# Altium schematic sheet Board_Diagram.SchDoc: STM32F446 CNC
size B; Author: AM; CompanyName: Expatria Technologies; DrawnBy: A.Marles; Engineer: AM; Organization: Expatria Technolgoies; Address1: PO Box 2084; Address3: Merritt, BC V1K 1B8; Address4: Canada; DocumentNumber: 2; SheetNumber: 2; SheetTotal: 26
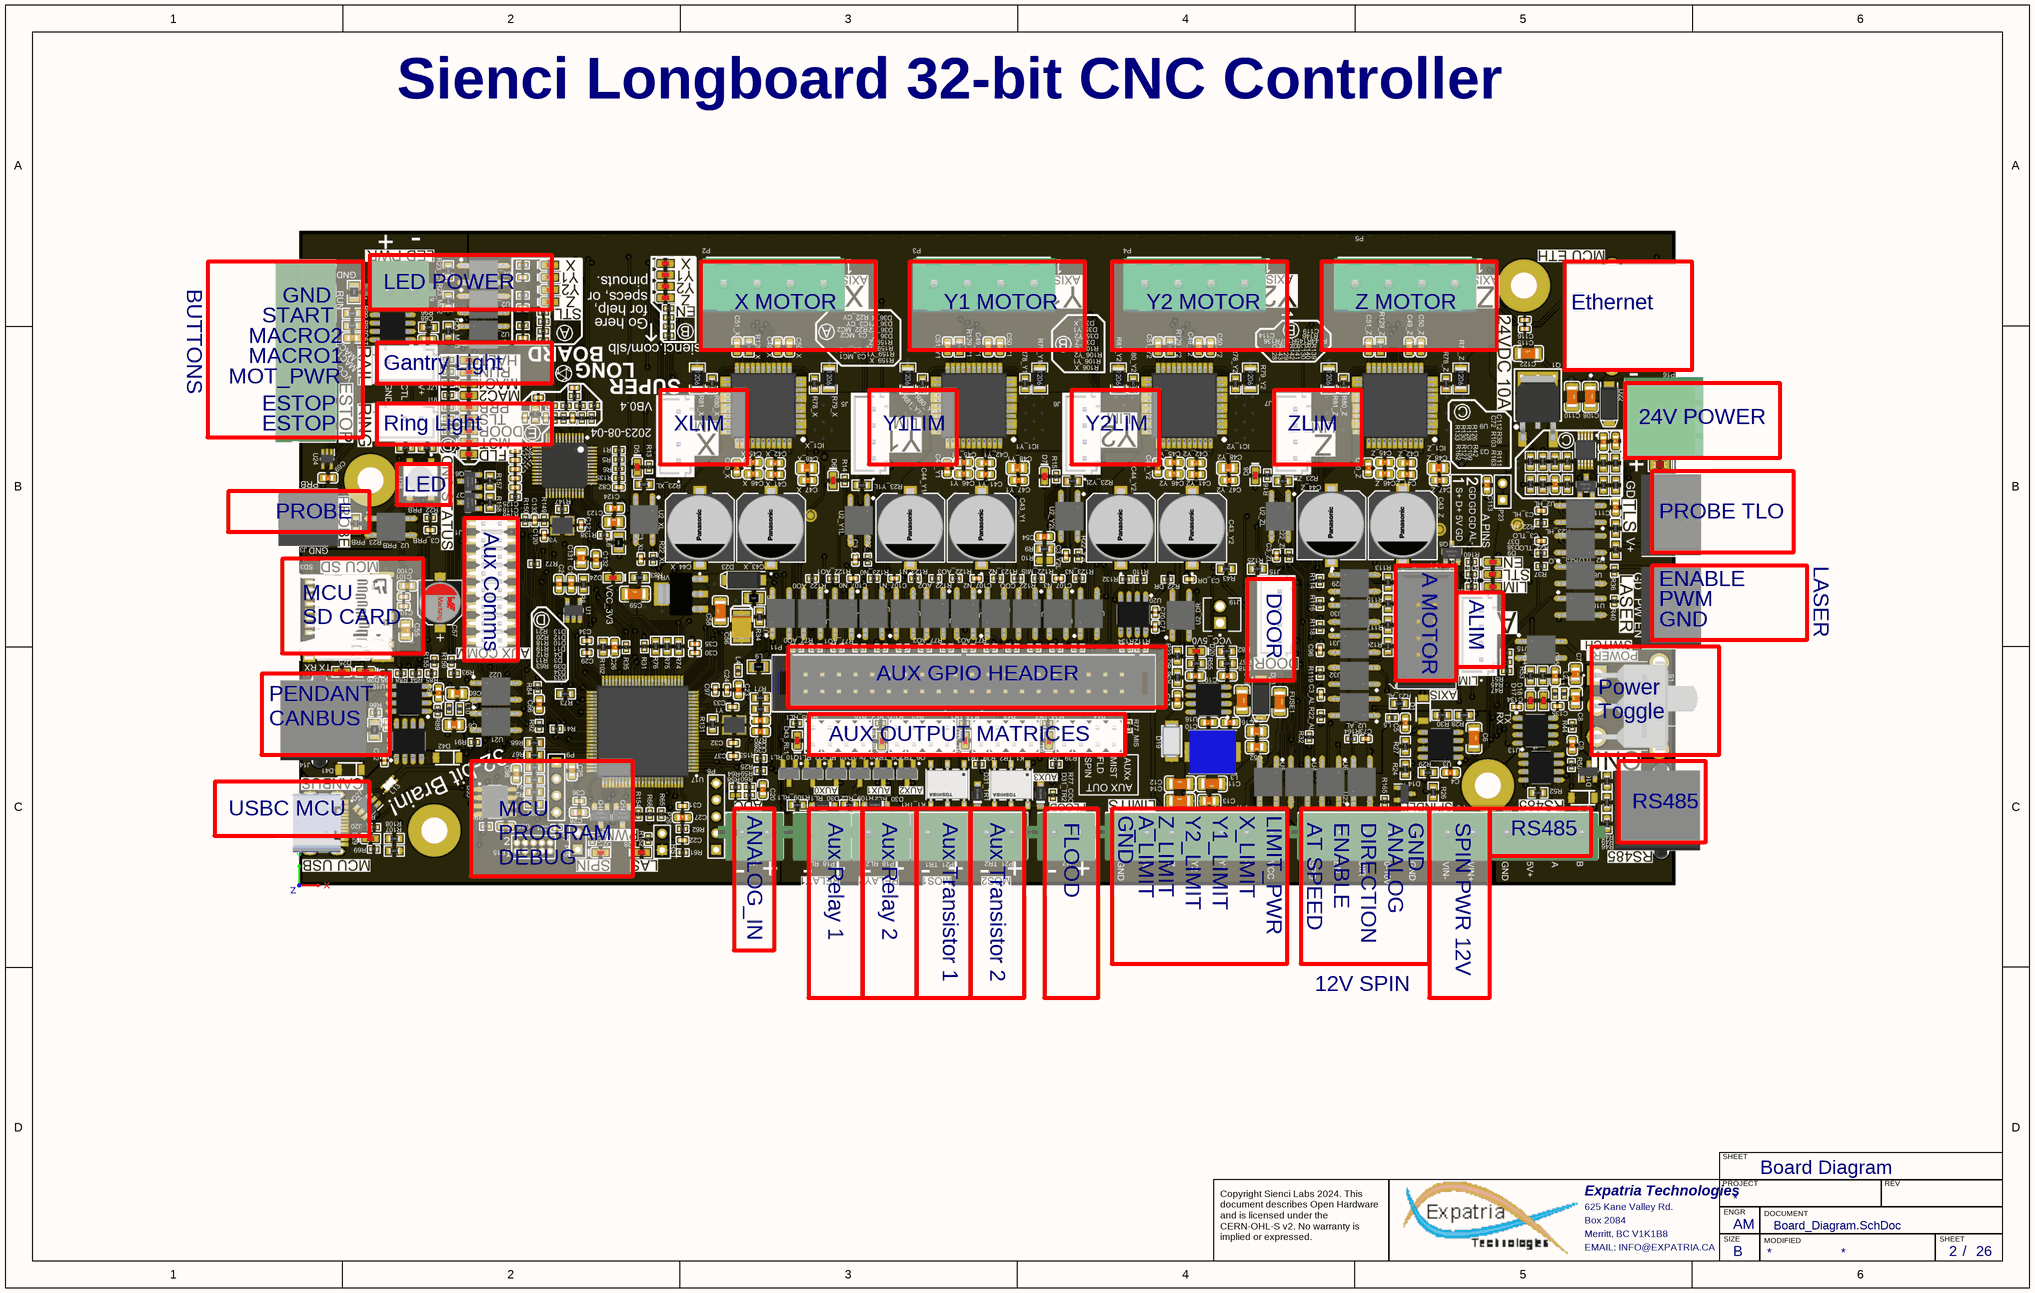
[diagram p0: Board_Diagram.SchDoc]

## Notes on the sheet
- Sienci Longboard 32-bit CNC Controller
- BUTTONS
- LED POWER
- MACRO1
- MACRO2
- START
- GND
- Gantry Light
- X MOTOR
- Y1 MOTOR
- Y2 MOTOR
- Z MOTOR
- Ethernet
- MOT_PWR
- ESTOP
- Ring Light
- XLIM
- Y1LIM
- Y2LIM
- ZLIM
- 24V POWER
- LED
- PROBE
- Aux Comms
- A MOTOR
- PROBE TLO
- LASER
- DOOR
- ALIM
- PWM
- ENABLE
- MCU
  SD CARD
- AUX GPIO HEADER
- PENDANT
  CANBUS
- AUX OUTPUT MATRICES
- Power
  Toggle
- USBC MCU
- ANALOG_IN
- Aux Relay 1
- Aux Relay 2
- Aux Transistor 1
- Aux Transistor 2
- FLOOD
- A_LIMIT
- Z_LIMIT
- Y2_LIMIT
- Y1_LIMIT
- X_LIMIT
- LIMIT_PWR
- AT SPEED
- DIRECTION
- ANALOG
- SPIN PWR 12V
- RS485
- MCU PROGRAM
  DEBUG
- 12V SPIN
- Board Diagram
- SHEET
- Expatria Technologies
- 625 Kane Valley Rd.
- Box 2084
- Merritt, BC V1K1B8
- PROJECT
- SIZE
- ENGR
- MODIFIED
- DOCUMENT
- REV
- Copyright Sienci Labs 2024. This document describes Open Hardware and is licensed under the CERN-OHL-S v2. No warranty is implied or expressed.
- EMAIL: INFO@EXPATRIA.CA
- B
- /